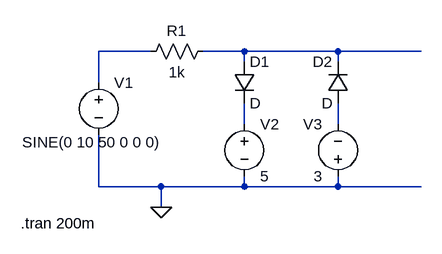
[diagram p0: schematic Lab4.asc]
Lab4.asc, the LTspice schematic file:
Version 4
SHEET 1 880 680
WIRE 144 64 64 64
WIRE 288 64 224 64
WIRE 432 64 288 64
WIRE 560 64 432 64
WIRE 288 80 288 64
WIRE 432 80 432 64
WIRE 64 112 64 64
WIRE 288 176 288 144
WIRE 432 176 432 144
WIRE 64 272 64 192
WIRE 160 272 64 272
WIRE 288 272 288 256
WIRE 288 272 160 272
WIRE 432 272 432 256
WIRE 432 272 288 272
WIRE 560 272 432 272
WIRE 160 304 160 272
FLAG 160 304 0
SYMBOL voltage 64 96 R0
WINDOW 3 -118 108 Left 2
WINDOW 123 0 0 Left 0
WINDOW 39 0 0 Left 0
SYMATTR InstName V1
SYMATTR Value SINE(0 10 50 0 0 0)
SYMBOL res 240 48 R90
WINDOW 0 0 56 VBottom 2
WINDOW 3 32 56 VTop 2
SYMATTR InstName R1
SYMATTR Value 1k
SYMBOL voltage 288 160 R0
WINDOW 123 0 0 Left 0
WINDOW 39 0 0 Left 0
SYMATTR InstName V2
SYMATTR Value 5
SYMBOL voltage 432 272 R180
WINDOW 0 24 96 Left 2
WINDOW 3 24 16 Left 2
WINDOW 123 0 0 Left 0
WINDOW 39 0 0 Left 0
SYMATTR InstName V3
SYMATTR Value 3
SYMBOL diode 272 80 R0
SYMATTR InstName D1
SYMBOL diode 448 144 R180
WINDOW 0 24 64 Left 2
WINDOW 3 24 0 Left 2
SYMATTR InstName D2
TEXT -56 328 Left 2 !.tran 200m

The netlist it stands for:
* Lab4.asc
V1 N001 0 SINE(0 10 50 0 0 0)
R1 N002 N001 1k
V2 N003 0 5
V3 0 N004 3
D1 N002 N003 D
D2 N004 N002 D
.model D D
.lib standard.dio
.tran 200m
.backanno
.end